# Altium schematic sheet ethernet.SchDoc: Ethernet 100-Base-T Port
size A4; SheetNumber: 10; SheetTotal: 18
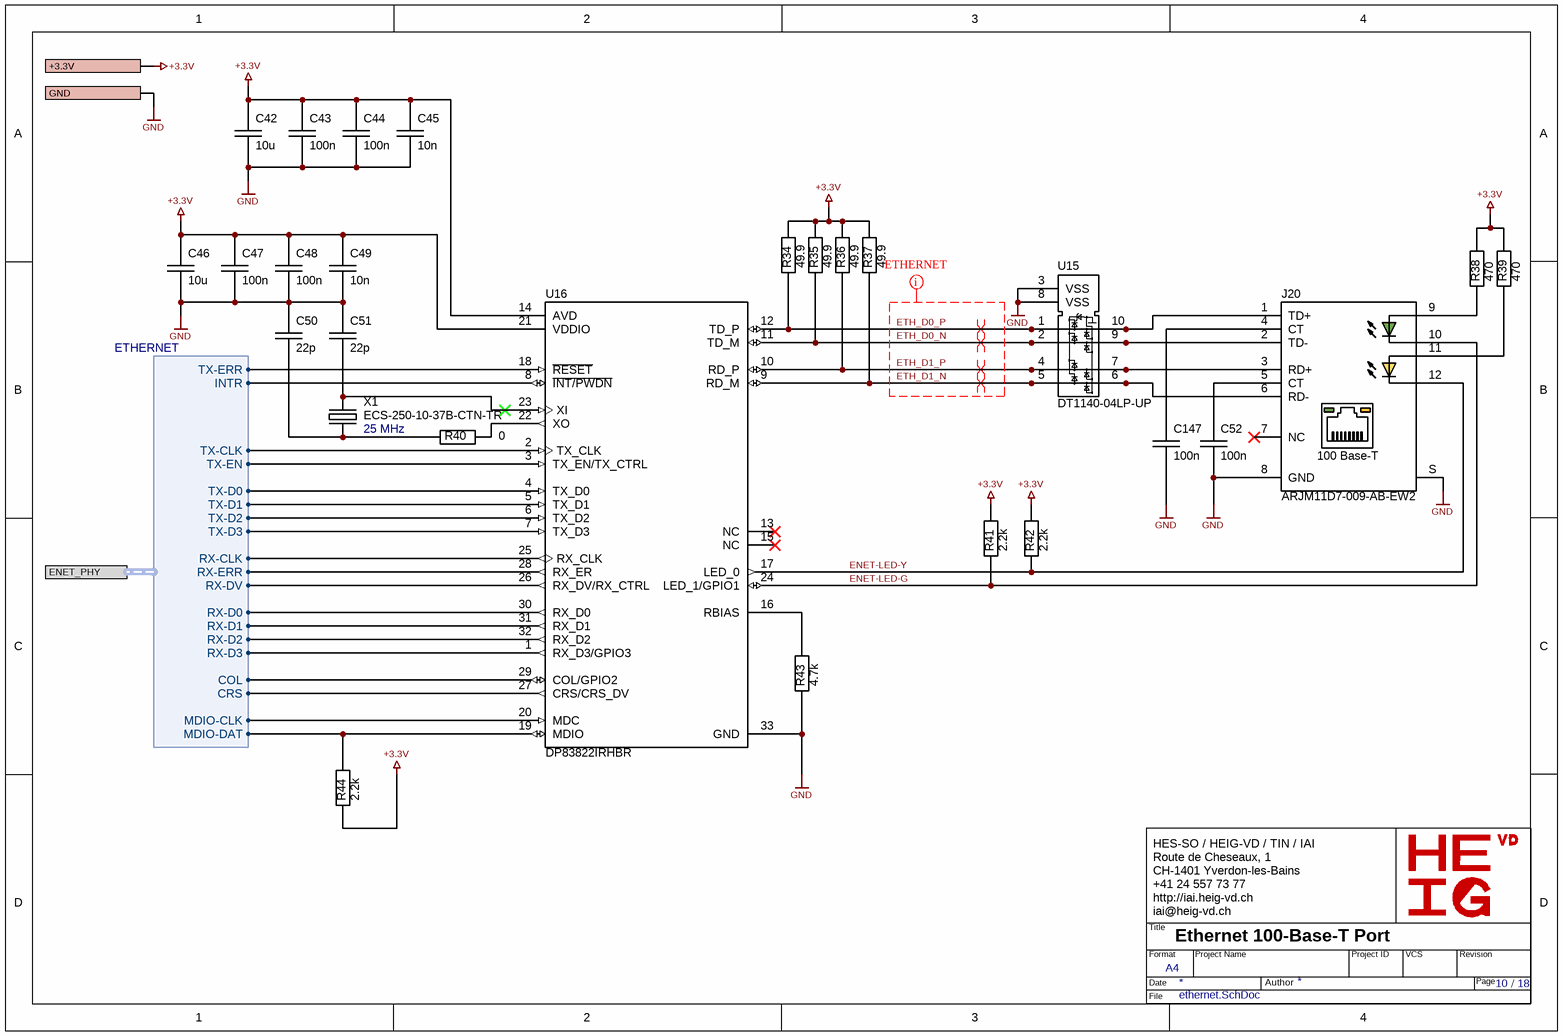
[diagram p0: ethernet.SchDoc]

## Parts
C42  10u  [SM/C0402]
C43  100n  [SM/C0402]
C44  100n  [SM/C0402]
C45  10n  [SM/C0402]
C46  10u  [SM/C0402]
C47  100n  [SM/C0402]
C48  100n  [SM/C0402]
C49  10n  [SM/C0402]
C50  22p  [SM/C0402]
C51  22p  [SM/C0402]
C52  100n  [SM/C0402]
C147  100n  [SM/C0402]
J20  ARJM11D7-009-AB-EW2  [ARJM11D7-009-AB-EW2]
R34  49.9  [SM/R0402]
R35  49.9  [SM/R0402]
R36  49.9  [SM/R0402]
R37  49.9  [SM/R0402]
R38  470  [SM/R0402]
R39  470  [SM/R0402]
R40  0  [SM/R0402]
R41  2.2k  [SM/R0402]
R42  2.2k  [SM/R0402]
R43  4.7k  [SM/R0402]
R44  2.2k  [SM/R0402]
U15  DT1140-04LP-UP  [SOT1165-1]
U16  DP83822IRHBR  [IC_DP83822IRHBR]
X1  ECS-250-10-37B-CTN-TR  value 25 MHz  [XTAL_ECS-160-9-37-CKM-TR]

## Ports
+3.3V, ENET_PHY (harness ETHERNET), GND

## Harnesses
ETHERNET: TX-D0, TX-D1, TX-D2, TX-D3, RX-D0, RX-D1, RX-D2, RX-D3, TX-CLK, TX-EN, RX-CLK, RX-DV, TX-ERR, COL, CRS, RX-ERR, MDIO-CLK, MDIO-DAT, INTR

## Nets
+3.3V: C42.1 C43.1 C44.1 C45.1 C46.1 C47.1 C48.1 C49.1 R34.1 R35.1 R36.1 R37.1 R38.1 R39.1 R41.2 R42.2 R44.1 U16.14(AVD) U16.21(VDDIO) ; port +3.3V
GND: C42.2 C43.2 C44.2 C45.2 C46.2 C47.2 C48.2 C49.2 C50.1 C51.2 C52.2 C147.2 J20.8(GND) J20.S R43.2 U15.3(VSS) U15.8(VSS) U16.33(GND) ; port GND
ENET-LED-G: J20.10(LED_GREEN2) R41.1 U16.24(LED_1/GPIO1)
ENET-LED-Y: J20.12(LED_YELLOW2) R42.1 U16.17(LED_0)
ETH_D0_N: J20.2(TD-) R35.2 U15.2 U15.9 U16.11(TD_M)
ETH_D0_P: J20.1(TD+) R34.2 U15.1 U15.10 U16.12(TD_P)
ETH_D1_N: J20.6(RD-) R37.2 U15.5 U15.6 U16.9(RD_M)
ETH_D1_P: J20.3(RD+) R36.2 U15.4 U15.7 U16.10(RD_P)
NetC50_2: C50.2 R40.1 X1.1
NetC51_1: C51.1 U16.23(XI) X1.3
NetC52_1: C52.1 J20.5(CT)
NetC147_1: C147.1 J20.4(CT)
NetJ20_9: J20.9(LED_GREEN1) R38.2
NetJ20_11: J20.11(LED_YELLOW1) R39.2
NetR40_2: R40.2 U16.22(XO)
NetR43_1: R43.1 U16.16(RBIAS)
NetR44_2: R44.2 U16.19(MDIO) ; port ENET_PHY.MDIO-DAT
NetU16_1: U16.1(RX_D3/GPIO3) ; port ENET_PHY.RX-D3
NetU16_2: U16.2(TX_CLK) ; port ENET_PHY.TX-CLK
NetU16_3: U16.3(TX_EN/TX_CTRL) ; port ENET_PHY.TX-EN
NetU16_4: U16.4(TX_D0) ; port ENET_PHY.TX-D0
NetU16_5: U16.5(TX_D1) ; port ENET_PHY.TX-D1
NetU16_6: U16.6(TX_D2) ; port ENET_PHY.TX-D2
NetU16_7: U16.7(TX_D3) ; port ENET_PHY.TX-D3
NetU16_8: U16.8(~{INT/PWDN}) ; port ENET_PHY.INTR
NetU16_18: U16.18(~{RESET}) ; port ENET_PHY.TX-ERR
NetU16_20: U16.20(MDC) ; port ENET_PHY.MDIO-CLK
NetU16_25: U16.25(RX_CLK) ; port ENET_PHY.RX-CLK
NetU16_26: U16.26(RX_DV/RX_CTRL) ; port ENET_PHY.RX-DV
NetU16_27: U16.27(CRS/CRS_DV) ; port ENET_PHY.CRS
NetU16_28: U16.28(RX_ER) ; port ENET_PHY.RX-ERR
NetU16_29: U16.29(COL/GPIO2) ; port ENET_PHY.COL
NetU16_30: U16.30(RX_D0) ; port ENET_PHY.RX-D0
NetU16_31: U16.31(RX_D1) ; port ENET_PHY.RX-D1
NetU16_32: U16.32(RX_D2) ; port ENET_PHY.RX-D2

Not connected (* = marked no-connect by the designer): J20 7(NC)*; U16 13(NC)* 15(NC)*

## Layout directives
differential pair; differential pair class Ethernet: ETH_D0_N, ETH_D0_P, ETH_D1_N, ETH_D1_P
net class ETH; rule Differential Pairs Routing [Pref Gap = 10.717mil    Min Gap  = 5.906mil    Max Gap  = 10.717milPref Width = 7.231mil    Min Width  = 5.906mil    Max Width  = 7.231mil]; rule Matched Net Lengths [Tolerance = 3mil]: ETH_D0_N, ETH_D0_P, ETH_D1_N, ETH_D1_P

## Notes on the sheet
- HES-SO / HEIG-VD / TIN / IAI
  Route de Cheseaux, 1
  CH-1401 Yverdon-les-Bains
  +41 24 557 73 77
  http://iai.heig-vd.ch
  iai@heig-vd.ch
- Title
- Format
- Date
- A4
- Project Name
- Author
- Project ID
- VCS
- Revision
- Page
- /
- File
- (in symbol CONN JACK 1PORT 100 BASE-T PCB) 100 Base-T

## Library data of the parts
C42 C46 = CAP CER 10UF 6.3V X5R 0402: 10 µF ±20% 6.3V Ceramic Capacitor X5R 0402 (1005 Metric); Supplier 1: Digi-Key; Supplier Part Number 1: 490-GRM155R60J106ME05JCT-ND; Value: 10u; Voltage: 6.3V; Dielectric: X5R
C43 C44 C47 C48 C52 C147 = CAP CER 100NF 25V X5R 0402: 100 nF ±10% 25V Ceramic Capacitor X5R 0402 (1005 Metric); Voltage: 25V; Dielectric: X5R; Supplier 1: Digi-Key; Supplier Part Number 1: 1276-1043-1-ND; Value: 100n
C45 C49 = CAP CER 10NF 50V X7R 0402: 10 nF ±10% 50V Ceramic Capacitor X7R 0402 (1005 Metric); Voltage: 50V; Dielectric: X7R; Supplier 1: Digi-Key; Supplier Part Number 1: 1276-1028-1-ND; Value: 10n
C50 C51 = CAP CER 22PF 50V C0G/NPO 0402: 22 pF ±2% 50V Ceramic Capacitor C0G, NP0 0402 (1005 Metric); Dielectric: NPO; Voltage: 50V; Value: 22p; Supplier 1: Digi-Key; Supplier Part Number 1: 311-1652-1-ND
J20 = CONN JACK 1PORT 100 BASE-T PCB: 1 Port RJ45Through Hole 10/100 Base-T, AutoMDIX; Supplier 1: Digi-Key; Supplier Part Number 1: 535-ARJM11D7-009-AB-EW2-ND
R34-R37 = RES 49.9 OHM 1% 1/16W 0402: 49.9 Ohms ±1% 0.063W, 1/16W Chip Resistor 0402 (1005 Metric) Moisture Resistant Thick Film; Supplier 1: Digi-Key; Supplier Part Number 1: 311-49.9LRCT-ND; Value: 49.9
R38 R39 = RES 470 OHM 1% 1/16W 0402: 470 Ohms ±1% 0.063W, 1/16W Chip Resistor 0402 (1005 Metric) Thick Film; Value: 470; Supplier 1: Digi-Key; Supplier Part Number 1: 13-RC0402FR-13470RLCT-ND
R40 = RES SMD 0 OHM JUMPER 1/10W 0402: 0 Ohms Jumper Chip Resistor 0402 (1005 Metric) Automotive AEC-Q200 Thick Film; Value: 0; Supplier 1: Digi-Key; Supplier Part Number 1: P0.0JCT-ND
R41 R42 R44 = RES 2.2K OHM 1% 1/16W 0402: 2.2 kOhms ±1% 0.063W, 1/16W Chip Resistor 0402 (1005 Metric) Moisture Resistant Thick Film; Value: 2.2k; Supplier 1: Digi-Key; Supplier Part Number 1: 311-2.20KLRCT-ND
R43 = RES 4.7K OHM 5% 1/16W 0402: 4.7 kOhms ±5% 0.063W, 1/16W Chip Resistor 0402 (1005 Metric) Moisture Resistant Thick Film; Value: 4.7k; Supplier 1: Digi-Key; Supplier Part Number 1: 311-4.7KJRCT-ND
U15 = DT1140-04LP-UP: TVS DIODE 5.5VWM 10VC U-DFN2510; Supplier 1: Digi-Key; Supplier Part Number 1: DT1140-04LP-7DICT-ND
U16 = DP83822IRHBR: Ethernet Interface 32-VQFN (5x5); Price: None; Package: None; Availability: Unavailable; MP: DP83822IRHBR; Value: *; Supplier 1: Digi-Key; Supplier Part Number 1: 296-47256-6-ND
X1 = ECS-250-10-37B-CTN-TR: 25 MHz ±10ppm Crystal 10pF 50 Ohms 4-SMD, No Lead; ESR: <50; Supplier 1: Digi-Key; Supplier Part Number 1: XC3065CT-ND